# Altium schematic sheet LCDwen.SchDoc
size A4
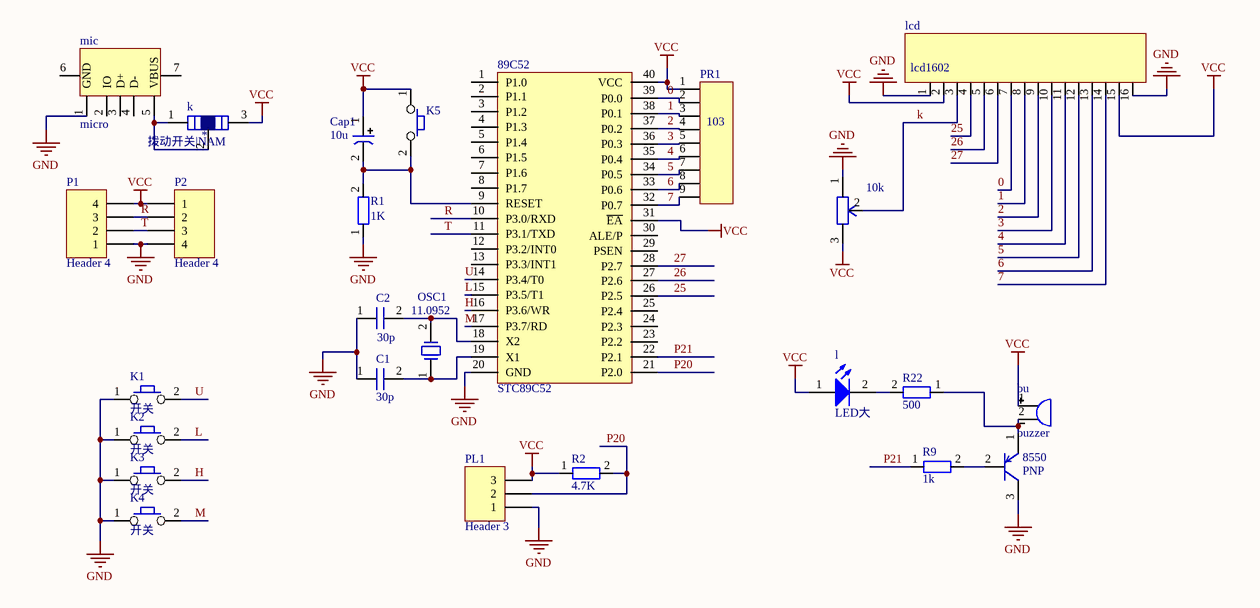
[diagram p0: LCDwen.SchDoc]

## Parts
10k  (no value)  [蓝白电位器]
89C52  STC89C52  [AT89C52]
8550  PNP  [三极管PNP]
bu  buzzer  [buzzer]
C1  30p  [电容。]
C2  30p  [电容。]
Cap1  10u  [电容]
k  *  [拨动开关]
K1  (no value)  [开关]
K2  (no value)  [开关]
K3  (no value)  [开关]
K4  (no value)  [开关]
K5  (no value)  [开关]
l  LED大  [LED大]
lcd  lcd1602  [lcd1602]
mic  micro  [MICRO]
OSC1  11.0952  [晶震]
P1  Header 4  [HDR1X4]
P2  Header 4  [HDR1X4]
PL1  Header 3  [HDR1X3]
PR1  103  [排阻]
R1  1K  [电阻]
R2  4.7K  [电阻]
R9  1k  [电阻]
R22  500  [电阻]

## Nets
GND: 10k.1 89C52.20(GND) 8550.3 C1.1 C2.1 K1.1 K2.1 K3.1 K4.1 lcd.1 lcd.16 mic.1(GND) P1.1 P2.4 PL1.1 R1.1
VCC: 10k.3 89C52.31(~{EA}) 89C52.40(VCC) bu.1 Cap1.1 k.3 K5.1 l.1 lcd.2 lcd.15 P1.4 P2.1 PL1.3 PR1.1 R2.1
0: 89C52.39(P0.0) lcd.7 PR1.2
1: 89C52.38(P0.1) lcd.8 PR1.3
2: 89C52.37(P0.2) lcd.9 PR1.4
3: 89C52.36(P0.3) lcd.10 PR1.5
4: 89C52.35(P0.4) lcd.11 PR1.6
5: 89C52.34(P0.5) lcd.12 PR1.7
6: 89C52.33(P0.6) lcd.13 PR1.8
7: 89C52.32(P0.7) lcd.14 PR1.9
25: 89C52.26(P2.5) lcd.4
26: 89C52.27(P2.6) lcd.5
27: 89C52.28(P2.7) lcd.6
H: 89C52.16(P3.6/WR) K3.2
k: 10k.2 lcd.3
L: 89C52.15(P3.5/T1) K2.2
M: 89C52.17(P3.7/RD) K4.2
P20: 89C52.21(P2.0) PL1.2 R2.2
P21: 89C52.22(P2.1) R9.1
R: 89C52.10(P3.0/RXD) P1.3 P2.2
T: 89C52.11(P3.1/TXD) P1.2 P2.3
U: 89C52.14(P3.4/T0) K1.2
Net89C52_9: 89C52.9(RESET) Cap1.2 K5.2 R1.2
Net89C52_18: 89C52.18(X2) C2.2 OSC1.2
Net89C52_19: 89C52.19(X1) C1.2 OSC1.1
Net8550_1: 8550.1 bu.2 R22.1
Net8550_2: 8550.2 R9.2
Netk_1: k.1 k.2 mic.5(VBUS)
Netl_2: l.2 R22.2

Not connected (* = marked no-connect by the designer): 89C52 1(P1.0) 2(P1.1) 3(P1.2) 4(P1.3) 5(P1.4) 6(P1.5) 7(P1.6) 8(P1.7) 12(P3.2/INT0) 13(P3.3/INT1) 23(P2.2) 24(P2.3) 25(P2.4) 29(PSEN) 30(ALE/P); mic 2(IO) 3(D+) 4(D-) 6 7

## Notes on the sheet
- (in symbol 拨动开关) 拨动开关|NAM

## Library data of the parts
10k = 蓝白电位器
C1 C2 = 电容
Cap1 = 电解电容
k = 拨动开关
K1-K5 = 开关
  K1-K4: Commen: 开关
OSC1 = 晶震
P1 P2 = Header 4: Header, 4-Pin; LatestRevisionDate: 17-Jul-2002; LatestRevisionNote: Re-released for DXP Platform.; Publisher: Altium Limited
PL1 = Header 3: Header, 3-Pin; LatestRevisionDate: 17-Jul-2002; LatestRevisionNote: Re-released for DXP Platform.; Publisher: Altium Limited
PR1 = 排阻
R1 R2 R9 R22 = 电阻